# EAGLE design retr3d-testbench (EAGLE 7.3.0)
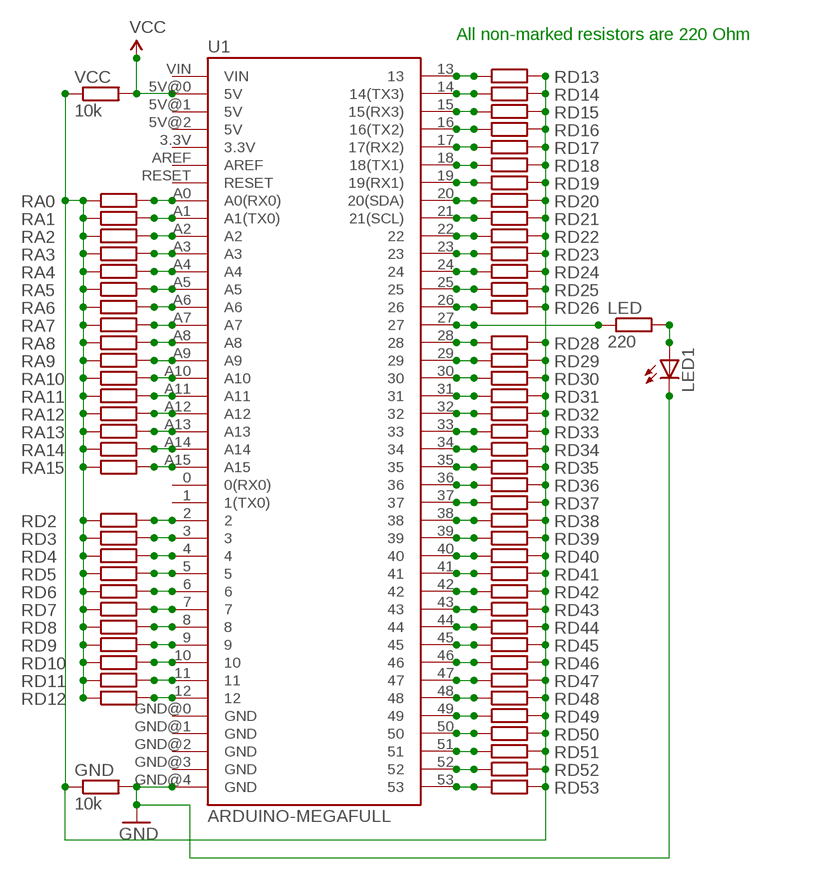
[diagram p0: schematic, sheet 1]

## Parts
GND  10k  R0207/10  [0207/10]
LED  220  R0207/10  [0207/10]
LED1  LED5MM  [LED5MM]
RA0  220  R0207/10  [0207/10]
RA1  220  R0207/10  [0207/10]
RA2  220  R0207/10  [0207/10]
RA3  220  R0207/10  [0207/10]
RA4  220  R0207/10  [0207/10]
RA5  220  R0207/10  [0207/10]
RA6  220  R0207/10  [0207/10]
RA7  220  R0207/10  [0207/10]
RA8  220  R0207/10  [0207/10]
RA9  220  R0207/10  [0207/10]
RA10  220  R0207/10  [0207/10]
RA11  220  R0207/10  [0207/10]
RA12  220  R0207/10  [0207/10]
RA13  220  R0207/10  [0207/10]
RA14  220  R0207/10  [0207/10]
RA15  220  R0207/10  [0207/10]
RD2  220  R0207/10  [0207/10]
RD3  220  R0207/10  [0207/10]
RD4  220  R0207/10  [0207/10]
RD5  220  R0207/10  [0207/10]
RD6  220  R0207/10  [0207/10]
RD7  220  R0207/10  [0207/10]
RD8  220  R0207/10  [0207/10]
RD9  220  R0207/10  [0207/10]
RD10  220  R0207/10  [0207/10]
RD11  220  R0207/10  [0207/10]
RD12  220  R0207/10  [0207/10]
RD13  220  R0207/10  [0207/10]
RD14  220  R0207/10  [0207/10]
RD15  220  R0207/10  [0207/10]
RD16  220  R0207/10  [0207/10]
RD17  220  R0207/10  [0207/10]
RD18  220  R0207/10  [0207/10]
RD19  220  R0207/10  [0207/10]
RD20  220  R0207/10  [0207/10]
RD21  220  R0207/10  [0207/10]
RD22  220  R0207/10  [0207/10]
RD23  220  R0207/10  [0207/10]
RD24  220  R0207/10  [0207/10]
RD25  220  R0207/10  [0207/10]
RD26  220  R0207/10  [0207/10]
RD28  220  R0207/10  [0207/10]
RD29  220  R0207/10  [0207/10]
RD30  220  R0207/10  [0207/10]
RD31  220  R0207/10  [0207/10]
RD32  220  R0207/10  [0207/10]
RD33  220  R0207/10  [0207/10]
RD34  220  R0207/10  [0207/10]
RD35  220  R0207/10  [0207/10]
RD36  220  R0207/10  [0207/10]
RD37  220  R0207/10  [0207/10]
RD38  220  R0207/10  [0207/10]
RD39  220  R0207/10  [0207/10]
RD40  220  R0207/10  [0207/10]
RD41  220  R0207/10  [0207/10]
RD42  220  R0207/10  [0207/10]
RD43  220  R0207/10  [0207/10]
RD44  220  R0207/10  [0207/10]
RD45  220  R0207/10  [0207/10]
RD46  220  R0207/10  [0207/10]
RD47  220  R0207/10  [0207/10]
RD48  220  R0207/10  [0207/10]
RD49  220  R0207/10  [0207/10]
RD50  220  R0207/10  [0207/10]
RD51  220  R0207/10  [0207/10]
RD52  220  R0207/10  [0207/10]
RD53  220  R0207/10  [0207/10]
U1  ARDUINO-MEGAFULL  [ARDUINO_MEGA]
VCC  10k  R0207/10  [0207/10]

## Nets
GND: GND.2 LED1.K(C) U1.GND@4(GND)
N$1: RD13.1 U1.13
N$3: LED.1 U1.27
N$4: RA0.2 U1.A0(A0(RX0))
N$5: LED1.A LED.2
N$7: RD15.1 U1.15(15(RX3))
N$8: RA2.2 U1.A2
N$11: RA4.2 U1.A4
N$13: RD17.1 U1.17(17(RX2))
N$14: RA6.2 U1.A6
N$17: RA8.2 U1.A8
N$19: RD19.1 U1.19(19(RX1))
N$20: RA10.2 U1.A10
N$21: RA11.2 U1.A11
N$23: RA12.2 U1.A12
N$24: RA13.2 U1.A13
N$25: RD21.1 U1.21(21(SCL))
N$26: RA14.2 U1.A14
N$27: RA15.2 U1.A15
N$28: RD22.1 U1.22
N$30: RD2.2 U1.2
N$32: RD3.2 U1.3
N$33: RD5.2 U1.5
N$34: RD24.1 U1.24
N$35: RD4.2 U1.4
N$36: RD6.2 U1.6
N$38: RD7.2 U1.7
N$39: RD9.2 U1.9
N$40: RD26.1 U1.26
N$41: RD8.2 U1.8
N$42: RD10.2 U1.10
N$43: RD11.2 U1.11
N$44: RD12.2 U1.12
N$46: RD28.1 U1.28
N$47: RD14.1 U1.14(14(TX3))
N$50: RD16.1 U1.16(16(TX2))
N$52: RD30.1 U1.30
N$53: RD18.1 U1.18(18(TX1))
N$56: RD20.1 U1.20(20(SDA))
N$58: RD32.1 U1.32
N$60: RD23.1 U1.23
N$63: RD25.1 U1.25
N$68: RD29.1 U1.29
N$71: RD31.1 U1.31
N$74: RD33.1 U1.33
N$75: RD34.1 U1.34
N$76: RD38.1 U1.38
N$77: RD35.1 U1.35
N$78: RD36.1 U1.36
N$80: RD37.1 U1.37
N$83: RD39.1 U1.39
N$84: RD40.1 U1.40
N$86: RD41.1 U1.41
N$87: RD42.1 U1.42
N$89: RD43.1 U1.43
N$90: RD44.1 U1.44
N$92: RD45.1 U1.45
N$93: RD46.1 U1.46
N$95: RD47.1 U1.47
N$96: RD53.1 U1.53
N$98: RD52.1 U1.52
N$99: RD51.1 U1.51
N$101: RD50.1 U1.50
N$102: RD49.1 U1.49
N$104: RD48.1 U1.48
N$168: RA1.2 U1.A1(A1(TX0))
N$174: RA3.2 U1.A3
N$180: RA5.2 U1.A5
N$186: RA7.2 U1.A7
N$192: RA9.2 U1.A9
N$TEST: GND.1 RA0.1 RA1.1 RA2.1 RA3.1 RA4.1 RA5.1 RA6.1 RA7.1 RA8.1 RA9.1 RA10.1 RA11.1 RA12.1 RA13.1 RA14.1 RA15.1 RD2.1 RD3.1 RD4.1 RD5.1 RD6.1 RD7.1 RD8.1 RD9.1 RD10.1 RD11.1 RD12.1 RD13.2 RD14.2 RD15.2 RD16.2 RD17.2 RD18.2 RD19.2 RD20.2 RD21.2 RD22.2 RD23.2 RD24.2 RD25.2 RD26.2 RD28.2 RD29.2 RD30.2 RD31.2 RD32.2 RD33.2 RD34.2 RD35.2 RD36.2 RD37.2 RD38.2 RD39.2 RD40.2 RD41.2 RD42.2 RD43.2 RD44.2 RD45.2 RD46.2 RD47.2 RD48.2 RD49.2 RD50.2 RD51.2 RD52.2 RD53.2 VCC.1
VCC: U1.5V@0(5V) VCC.2
Unconnected: U1.0(0(RX0)) U1.1(1(TX0)) U1.3.3V U1.5V@1(5V) U1.5V@2(5V) U1.AREF U1.GND@0(GND) U1.GND@1(GND) U1.GND@2(GND) U1.GND@3(GND) U1.RESET U1.VIN

## Notes on the sheet
- All non-marked resistors are 220 Ohm

## Library data of the parts
GND LED RA0 RA1-RA15 RD2-RD26 RD28-RD53 VCC = eagle-ltspice:R: RESISTOR, European symbol; SPICEMODEL: NONE; SPICEPREFIX: R
LED1 = led:LED: LED OSRAM: - CHIPLED LG R971, LG N971, LY N971, LG Q971, LY Q971, LO R971, LY R971 LH N974, LH R974 LS Q976, LO Q976, LY Q976 LO Q996 - Hyper CHIPLED LW Q18S LB Q993, LB Q99A, LB R99A - SideLED LS A670, LO A670, LY A670, LG A670, LP A670 LB A673, LV A673, LT A673, LW A673 LH A674 LY A675 LS A676, LA A676, LO A676, LY A676, LW A676 LS A679, LY A679, LG A679 - Hyper Micro SIDELED® LS Y876, LA Y876, LO Y876, LY Y876 LT Y87S - SmartLED LW L88C, LW L88S LB L89C, LB L89S, LG L890 LS L89K, LO L89K, LY L89K LS L896, LA L896, LO L896, LY L896 - TOPLED LS T670, LO T670, LY T670, LG T670, LP T670 LSG T670, LSP T670, LSY T670, LOP T670, LYG T670 LG T671, LOG T671, LSG T671 LB T673, LV T673, LT T673, LW T673 LH T674 LS T676, LA T676, LO T676, LY T676, LB T676, LH T676, LSB T676, LW T676 LB T67C, LV T67C, LT T67C, LS T67K, LO T67K, LY T67K, LW E67C LS E67B, LA E67B, LO E67B, LY E67B, LB E67C, LV E67C, LT E67C LW T67C LS T679, LY T679, LG T679 LS T770, LO T770, LY T770, LG T770, LP T770 LB T773, LV T773, LT T773, LW T773 LH T774 LS E675, LA E675, LY E675, LS T675 LS T776, LA T776, LO T776, LY T776, LB T776 LHGB T686 LT T68C, LB T68C - Hyper Mini TOPLED® LB M676 - Mini TOPLED Santana® LG M470 LS M47K, LO M47K, LY M47K Source: http://www.osram.convergy.de LUXEON: - LUMILED® LXK2-PW12-R00, LXK2-PW12-S00, LXK2-PW14-U00, LXK2-PW14-V00 LXK2-PM12-R00, LXK2-PM12-S00, LXK2-PM14-U00 LXK2-PE12-Q00, LXK2-PE12-R00, LXK2-PE12-S00, LXK2-PE14-T00, LXK2-PE14-U00 LXK2-PB12-K00, LXK2-PB12-L00, LXK2-PB12-M00, LXK2-PB14-N00, LXK2-PB14-P00, LXK2-PB14-Q00 LXK2-PR12-L00, LXK2-PR12-M00, LXK2-PR14-Q00, LXK2-PR14-R00 LXK2-PD12-Q00, LXK2-PD12-R00, LXK2-PD12-S00 LXK2-PH12-R00, LXK2-PH12-S00 LXK2-PL12-P00, LXK2-PL12-Q00, LXK2-PL12-R00 Source: www.luxeon.com KINGBRIGHT: KA-3528ASYC Source: www.kingbright.com
U1 = SparkFun-Boards:ARDUINO-MEGA: Arduino Mega board footprint

## Board
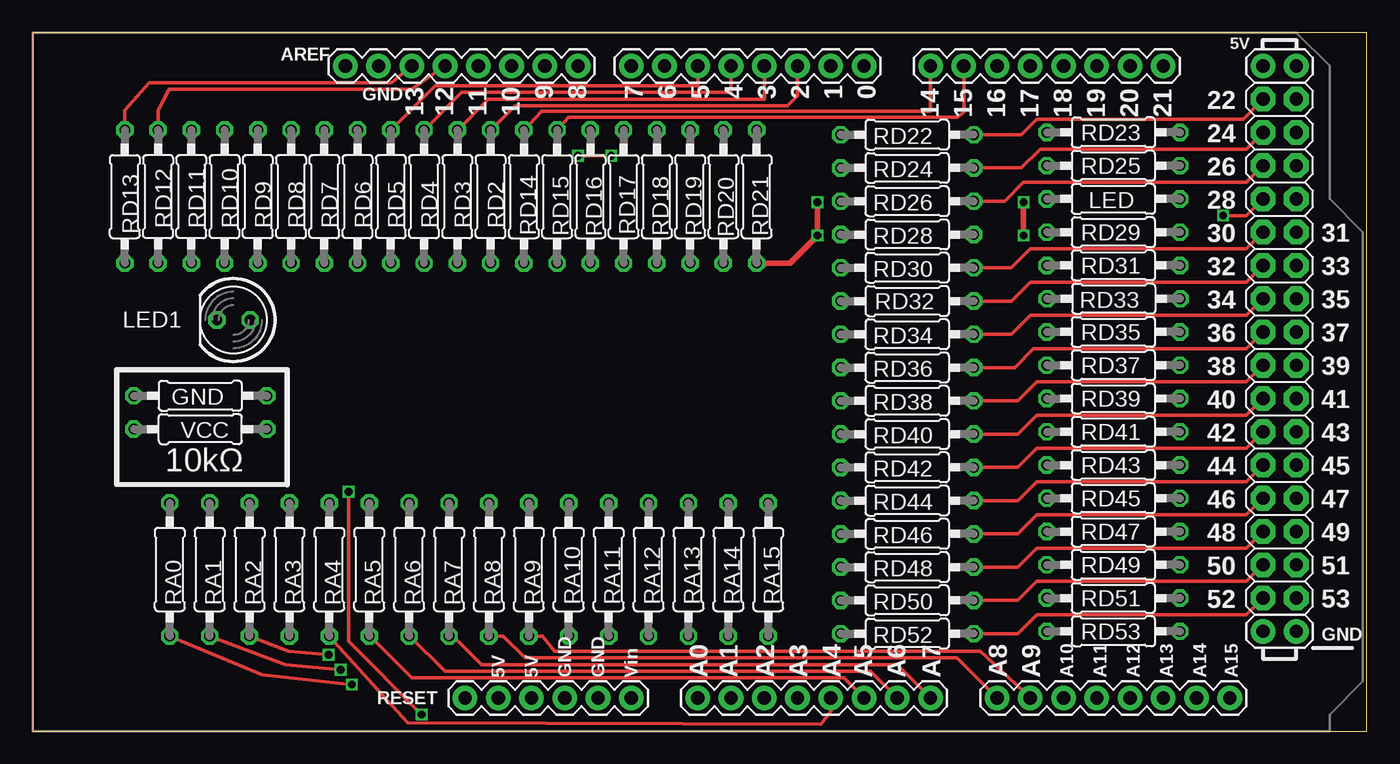
[diagram p1: board, top side]
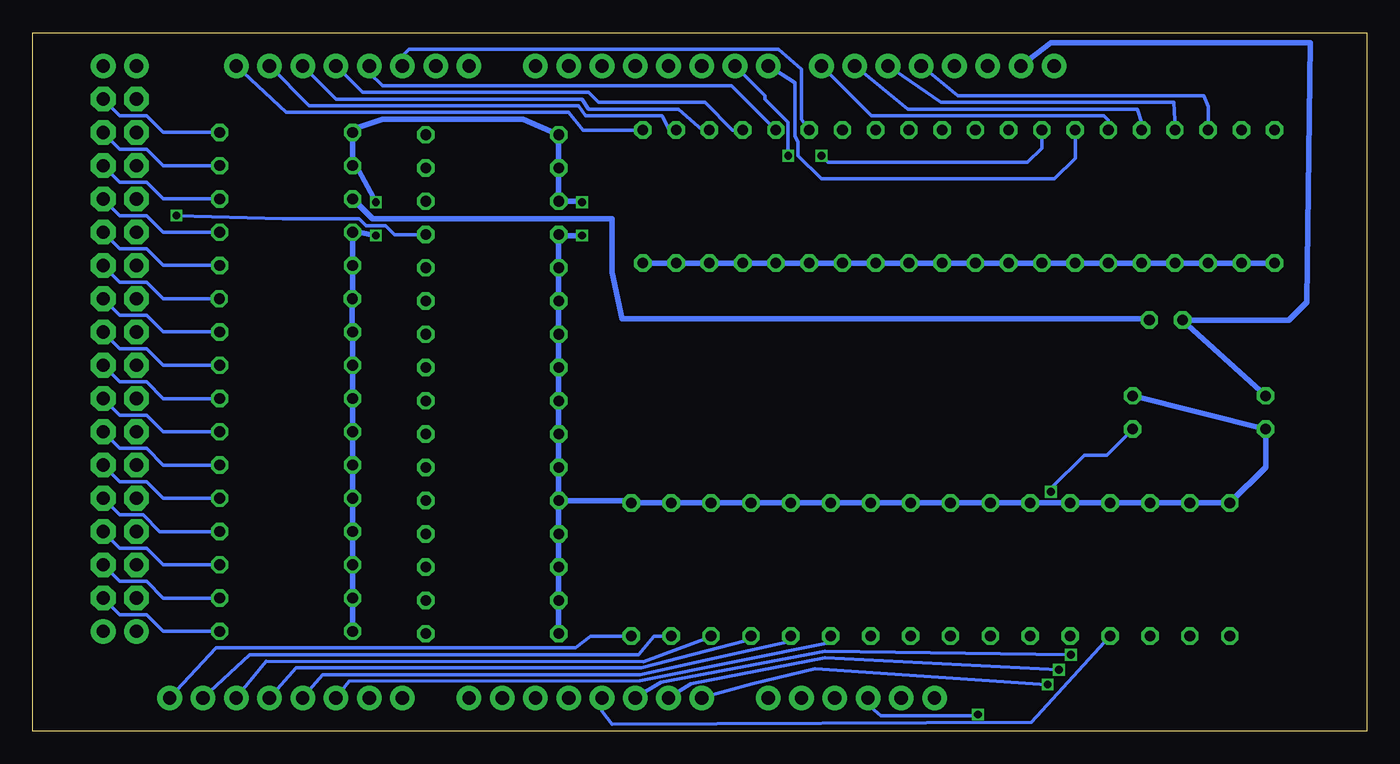
[diagram p2: board, bottom side, seen from below]

Size 101.91 x 53.33 mm. Coordinates in mm from the lower left corner, seen from the top.
Outline: 0,0 101.91,0 101.91,53.33 0,53.33 0,0
Copper layers (1*16): Top 0.035mm / dielectric 1.5mm / Bottom 0.035mm
Design rules "SeeedStudio_2layer_DRU_no_angle_20140221": minimum track width 6mil, minimum drill 12mil, track to track 6mil, track to pad 6mil, pad to pad 6mil, via to via 6mil, smd to smd 0mil, copper to edge 10mil, drill to drill 10mil, minimum pad ring 10mil, minimum via ring 6mil, stop-mask expansion 2mil, vias tented up to drill 100mil, thermal gap 10mil

### Footprints (pad centres in the part's own frame; a part is rotated, then mirrored left to right if it is on the bottom)
0207/10 = drill 0.813 octagon: 1 -5.08,0; 2 5.08,0
LED5MM = drill 0.813 octagon: A -1.27,0; K 1.27,0
ARDUINO_MEGA = drill 1.016 pad 1.88: 0 63.5,50.8; 1 60.96,50.8; 2 58.42,50.8; 3 55.88,50.8; 3.3V 35.56,2.54; 4 53.34,50.8; 5 50.8,50.8; 5V@0 38.1,2.54; 5V@1 93.98,50.8; 5V@2 96.52,50.8; 6 48.26,50.8; 7 45.72,50.8; 8 41.656,50.8; 9 39.116,50.8; 10 36.576,50.8; 11 34.036,50.8; 12 31.496,50.8; 13 28.956,50.8; 14 68.58,50.8; 15 71.12,50.8; 16 73.66,50.8; 17 76.2,50.8; 18 78.74,50.8; 19 81.28,50.8; 20 83.82,50.8; 21 86.36,50.8; A0 50.8,2.54; A1 53.34,2.54; A2 55.88,2.54; A3 58.42,2.54; A4 60.96,2.54; A5 63.5,2.54; A6 66.04,2.54; A7 68.58,2.54; A8 73.66,2.54; A9 76.2,2.54; A10 78.74,2.54; A11 81.28,2.54; A12 83.82,2.54; A13 86.36,2.54; A14 88.9,2.54; A15 91.44,2.54; AREF 23.876,50.8; GND@0 40.64,2.54; GND@1 43.18,2.54; GND@2 93.98,7.62; GND@3 96.52,7.62; GND@4 26.416,50.8; RESET 33.02,2.54; VIN 45.72,2.54 | drill 1.016 pad 1.88 octagon: 22 93.98,48.26; 23 96.52,48.26; 24 93.98,45.72; 25 96.52,45.72; 26 93.98,43.18; 27 96.52,43.18; 28 93.98,40.64; 29 96.52,40.64; 30 93.98,38.1; 31 96.52,38.1; 32 93.98,35.56; 33 96.52,35.56; 34 93.98,33.02; 35 96.52,33.02; 36 93.98,30.48; 37 96.52,30.48; 38 93.98,27.94; 39 96.52,27.94; 40 93.98,25.4; 41 96.52,25.4; 42 93.98,22.86; 43 96.52,22.86; 44 93.98,20.32; 45 96.52,20.32; 46 93.98,17.78; 47 96.52,17.78; 48 93.98,15.24; 49 96.52,15.24; 50 93.98,12.7; 51 96.52,12.7; 52 93.98,10.16; 53 96.52,10.16

### Placement (x,y rotation side)
GND  12.8,25.6 180 top
LED  82.55,40.64 180 top
LED1  15.34,31.39 180 top
RA0  10.46,12.34 270 top
RA1  13.51,12.34 270 top
RA2  16.56,12.34 270 top
RA3  19.61,12.34 270 top
RA4  22.66,12.34 270 top
RA5  25.7,12.34 270 top
RA6  28.75,12.34 270 top
RA7  31.8,12.34 270 top
RA8  34.85,12.34 270 top
RA9  37.9,12.34 270 top
RA10  40.94,12.34 270 top
RA11  43.99,12.34 270 top
RA12  47.04,12.34 270 top
RA13  50.09,12.34 270 top
RA14  53.14,12.34 270 top
RA15  56.18,12.34 270 top
RD2  34.98,40.82 90 top
RD3  32.44,40.82 90 top
RD4  29.9,40.82 90 top
RD5  27.36,40.82 90 top
RD6  24.82,40.82 90 top
RD7  22.28,40.82 90 top
RD8  19.74,40.82 90 top
RD9  17.2,40.82 90 top
RD10  14.66,40.82 90 top
RD11  12.12,40.82 90 top
RD12  9.58,40.82 90 top
RD13  7.04,40.82 270 top
RD14  37.52,40.82 270 top
RD15  40.06,40.82 270 top
RD16  42.6,40.82 270 top
RD17  45.14,40.82 270 top
RD18  47.68,40.82 270 top
RD19  50.22,40.82 270 top
RD20  52.76,40.82 270 top
RD21  55.3,40.82 270 top
RD22  66.8,45.54 180 top
RD23  82.55,45.72 180 top
RD24  66.8,43 180 top
RD25  82.55,43.18 180 top
RD26  66.8,40.46 180 top
RD28  66.8,37.92 180 top
RD29  82.55,38.1 180 top
RD30  66.8,35.38 180 top
RD31  82.55,35.56 180 top
RD32  66.8,32.84 180 top
RD33  82.58,33.02 180 top
RD34  66.8,30.3 180 top
RD35  82.55,30.48 180 top
RD36  66.8,27.76 180 top
RD37  82.55,27.94 180 top
RD38  66.8,25.22 180 top
RD39  82.55,25.4 180 top
RD40  66.8,22.68 180 top
RD41  82.55,22.86 180 top
RD42  66.8,20.14 180 top
RD43  82.55,20.32 180 top
RD44  66.8,17.6 180 top
RD45  82.55,17.78 180 top
RD46  66.8,15.06 180 top
RD47  82.55,15.24 180 top
RD48  66.8,12.52 180 top
RD49  82.55,12.7 180 top
RD50  66.8,9.98 180 top
RD51  82.55,10.16 180 top
RD52  66.8,7.44 180 top
RD53  82.55,7.62 180 top
U1  0,0 0 top
VCC  12.8,23.06 0 top

### Tracks (layer width: path | path; a pad name or v marks a point on that pad's centre or on a via)
GND
  Bottom 0.406: GND.2 LED1.K 5.94,31.39 4.57,32.77 4.32,52.58 24.13,52.58 U1.GND@4
N$1
  Top 0.254: RD13.1 7.04,47.42 8.89,49.53 27.43,49.53 U1.13
N$3
  Bottom 0.254: LED.1 91.95,40.64 93.22,41.91 95.25,41.91 U1.27
N$4  (via drill 0.6)
  Top 0.254: v24.38,3.56 17.53,4.32 RA0.2
  Bottom 0.254: U1.A0 46.91,3.61 42.16,4.75 v24.38,3.56
N$5
  Bottom 0.406: LED.2 75.95,39.12 57.66,39.12 57.66,35.05 56.9,31.5 16.71,31.5 LED1.A
N$7
  Top 0.254: U1.15 71.12,47.24 70.64,46.86 40.92,46.86 RD15.1
N$8  (via drill 0.6)
  Top 0.254: v22.61,5.84 19.56,6.1 RA2.2
  Bottom 0.254: U1.A2 53.9,3.73 41.4,6.1 v22.61,5.84
N$11
  Top 0.254: U1.A4 60.96,1.52 60.2,0.51 28.65,0.63 RA4.2
N$13
  Bottom 0.254: U1.17 76.2,50.29 75.18,49.28 48.51,49.28 RD17.1
N$14
  Top 0.254: RA6.2 28.8,7.26 31.5,4.57 64.01,4.57 U1.A6
N$17
  Top 0.254: RA8.2 35.92,7.26 37.59,5.59 70.61,5.59 U1.A8
N$19
  Bottom 0.254: RD19.1 50.72,45.9 52.58,47.5 59.44,47.5 59.94,48.26 78.74,48.26 U1.19
N$20
  Bottom 0.254: RA10.2 40.89,6.78 55.52,3.86 77.72,3.81 U1.A10
N$21
  Bottom 0.254: RA11.2 43.84,6.91 55.52,4.29 79.76,4.32 U1.A11
N$23
  Bottom 0.254: RA12.2 47.45,6.88 55.4,4.83 81.79,4.83 U1.A12
N$24
  Bottom 0.254: RA13.2 50.22,7.19 55.24,5.31 84.07,5.33 U1.A13
N$25
  Bottom 0.254: RD21.1 59.87,45.9 60.96,47.24 82.55,47.24 U1.21
N$26
  Bottom 0.254: RA14.2 54.46,7.26 55.63,5.84 85.34,5.84 U1.A14
N$27
  Bottom 0.254: RA15.2 59.28,7.26 60.45,6.35 87.88,6.35 U1.A15
N$28
  Top 0.254: RD22.1 75.51,45.54 76.71,46.74 92.46,46.74 U1.22
N$30
  Top 0.254: U1.2 58.42,48.51 57.66,47.75 36.83,47.75 RD2.2
N$32
  Top 0.254: U1.3 55.88,48.26 34.8,48.26 RD3.2
N$33
  Top 0.254: U1.5 50.8,49.28 30.73,49.28 RD5.2
N$34
  Top 0.254: RD24.1 75.51,43 76.96,44.45 92.71,44.45 U1.24
N$35
  Top 0.254: U1.4 53.34,48.77 32.77,48.77 RD4.2
N$36  (via drill 0.6)
  Top 0.254: v41.66,43.94 v44.2,43.94
  Bottom 0.254: RD6.2 24.82,44.53 25.91,43.43 41.15,43.43 v41.66,43.94 | v44.2,43.94 44.2,46.48 45.97,48.26 45.97,48.51 U1.6
N$38
  Bottom 0.254: RD7.2 22.28,43.76 23.88,42.16 41.66,42.16 43.43,43.94 43.43,44.96 43.69,45.47 43.69,49.53 U1.7
N$39
  Bottom 0.254: RD9.2 17.2,46.41 17.53,47.5 35.05,47.5 U1.9
N$40
  Top 0.254: RD26.1 74.24,40.46 75.69,41.91 92.71,41.91 U1.26
N$41
  Bottom 0.254: RD8.2 19.74,46.66 20.07,46.99 37.85,46.99 U1.8
N$42
  Bottom 0.254: RD10.2 14.66,46.66 14.73,48.01 32.51,48.01 U1.10
N$43
  Bottom 0.254: RD11.2 12.12,47.68 12.45,48.51 31.24,48.51 U1.11
N$44
  Top 0.254: RD12.2 9.58,47.42 10.41,49.02 28.96,49.02 U1.12
N$46  (via drill 0.6)
  Top 0.254: v90.93,39.37 92.71,39.37 U1.28
  Bottom 0.254: RD28.1 74.24,37.92 74.93,38.61 76.45,38.61 76.96,39.12 82.8,39.12 v90.93,39.37
N$47
  Top 0.254: U1.14 68.58,47.32 38.86,47.32 RD14.1
N$50
  Bottom 0.254: U1.16 73.66,51.56 73.15,52.07 44.96,52.07 43.18,50.55 43.18,46.74 RD16.1
N$52
  Top 0.254: RD30.1 74.75,35.38 76.2,36.83 92.71,36.83 U1.30
N$53
  Bottom 0.254: RD18.1 48.44,45.9 50.55,48.01 58.67,48.01 59.44,48.77 76.71,48.77 U1.18
N$56
  Bottom 0.254: RD20.1 53.26,45.9 53.85,46.99 59.69,46.99 60.2,47.75 80.77,47.75 U1.20
N$58
  Top 0.254: RD32.1 74.75,32.84 76.2,34.29 92.71,34.29 U1.32
N$60
  Bottom 0.254: RD23.1 91.95,45.72 93.22,46.99 95.25,46.99 U1.23
N$63
  Bottom 0.254: RD25.1 91.95,43.18 93.22,44.45 95.25,44.45 U1.25
N$68
  Bottom 0.254: RD29.1 91.95,38.1 93.22,39.37 95.25,39.37 U1.29
N$71
  Bottom 0.254: RD31.1 91.95,35.56 93.22,36.83 95.25,36.83 U1.31
N$74
  Bottom 0.254: RD33.1 91.95,33.02 93.22,34.29 95.25,34.29 U1.33
N$75
  Top 0.254: RD34.1 74.75,30.3 76.2,31.75 92.71,31.75 U1.34
N$76
  Top 0.254: RD38.1 75.26,25.22 76.71,26.67 92.71,26.67 U1.38
N$77
  Bottom 0.254: RD35.1 91.95,30.48 93.22,31.75 95.25,31.75 U1.35
N$78
  Top 0.254: RD36.1 75.01,27.76 76.45,29.21 92.71,29.21 U1.36
N$80
  Bottom 0.254: RD37.1 91.95,27.94 93.22,29.21 95.25,29.21 U1.37
N$83
  Bottom 0.254: RD39.1 91.95,25.4 93.22,26.67 95.25,26.67 U1.39
N$84
  Top 0.254: RD40.1 75.26,22.68 76.71,24.13 92.71,24.13 U1.40
N$86
  Bottom 0.254: RD41.1 91.95,22.86 93.22,24.13 95.25,24.13 U1.41
N$87
  Top 0.254: RD42.1 75.26,20.14 76.71,21.59 92.71,21.59 U1.42
N$89
  Bottom 0.254: RD43.1 91.95,20.32 93.22,21.59 95.25,21.59 U1.43
N$90
  Top 0.254: RD44.1 75.26,17.6 76.71,19.05 92.71,19.05 U1.44
N$92
  Bottom 0.254: RD45.1 91.95,17.78 93.22,19.05 95.25,19.05 U1.45
N$93
  Top 0.254: RD46.1 75.26,15.06 76.71,16.51 92.71,16.51 U1.46
N$95
  Bottom 0.254: RD47.1 92.2,15.24 93.47,16.51 95.25,16.51 U1.47
N$96
  Bottom 0.254: RD53.1 91.95,7.62 93.22,8.89 95.25,8.89 U1.53
N$98
  Top 0.254: RD52.1 75.26,7.44 76.71,8.89 92.71,8.89 U1.52
N$99
  Bottom 0.254: RD51.1 91.95,10.16 93.22,11.43 95.25,11.43 U1.51
N$101
  Top 0.254: RD50.1 75.26,9.98 76.71,11.43 92.71,11.43 U1.50
N$102
  Bottom 0.254: RD49.1 91.95,12.7 93.22,13.97 95.25,13.97 U1.49
N$104
  Top 0.254: RD48.1 75.26,12.52 76.71,13.97 92.71,13.97 U1.48
N$168  (via drill 0.6)
  Top 0.254: v23.52,4.7 19.3,5.08 RA1.2
  Bottom 0.254: U1.A1 51.61,3.63 41.4,5.59 v23.52,4.7
N$174
  Bottom 0.254: U1.A3 58.42,1.52 57.66,0.51 25.6,0.66 RA3.2
N$180
  Top 0.254: RA5.2 25.76,7.26 28.96,4.06 61.98,4.06 U1.A5
N$186
  Top 0.254: RA7.2 32.11,7.26 34.29,5.08 66.04,5.08 U1.A7
N$192
  Top 0.254: RA9.2 38.96,7.26 39.88,6.1 72.39,6.1 U1.A9
N$TEST  (via drill 0.6)
  Top 0.406: v59.94,40.39 v59.94,37.85 57.84,35.74 RD21.2 | v75.69,40.39 v75.69,37.85
  Bottom 0.406: GND.1 VCC.1 7.72,20.17 RA0.1 RA1.1 RA2.1 RA3.1 RA4.1 RA5.1 RA6.1 RA7.1 RA8.1 RA9.1 RA10.1 RA11.1 RA12.1 RA13.1 RA14.1 RA15.1 56.36,17.6 RD44.2 | RD13.2 RD12.1 RD11.1 RD10.1 RD9.1 RD8.1 RD7.1 RD6.1 RD5.1 RD4.1 RD3.1 RD2.1 RD14.2 RD15.2 RD16.2 RD17.2 RD18.2 RD19.2 RD20.2 RD21.2 | v59.94,40.39 60.02,40.46 RD26.2 RD24.2 RD22.2 64.44,46.74 75.18,46.74 77.47,45.97 RD23.2 RD25.2 77.22,43.18 v75.69,40.39 | v59.94,37.85 61.65,37.85 RD28.2 RD30.2 RD32.2 RD34.2 RD36.2 RD38.2 RD40.2 RD42.2 RD44.2 | RD44.2 RD46.2 RD48.2 RD50.2 RD52.2 | v75.69,37.85 76.96,38.1 RD29.2 RD31.2 77.47,33.05 RD33.2 77.5,30.5 RD35.2 RD37.2 RD39.2 RD41.2 RD43.2 RD45.2 RD47.2 RD49.2 RD51.2 RD53.2
VCC  (via drill 0.6)
  Top 0.254: v29.72,1.27 24.13,6.86 v24.13,18.29
  Bottom 0.254: U1.5V@0 38.1,2.03 37.11,1.17 30.25,1.17 v29.72,1.27 | v24.13,18.29 24.13,18.54 21.59,21.08 19.86,21.08 VCC.2

### Text on the board
tPlace: 10kΩ
BMP: C:/Users/Master/Git/retr3d/docs/retr3dSilkscreen.bmp
217bmp: C:/Users/Master/Git/retr3d/docs/retr3dSilkscreen-testbench.bmp
BottomText: For assembly and usage goto | Github.com/masterperson40/Retr3d-Testbench